# EasyEDA Pro project 外接板20250811.eprj

# Schematic Schematic1
Board Name: Board1; Create Date: 2025-08-11; Page Name: P1; Project Name: 外接板20250811; Schematic Name: Schematic1; Update Date: 2025-08-11; Company: 嘉立创EDA; Page Size: A4; Version: V1.0
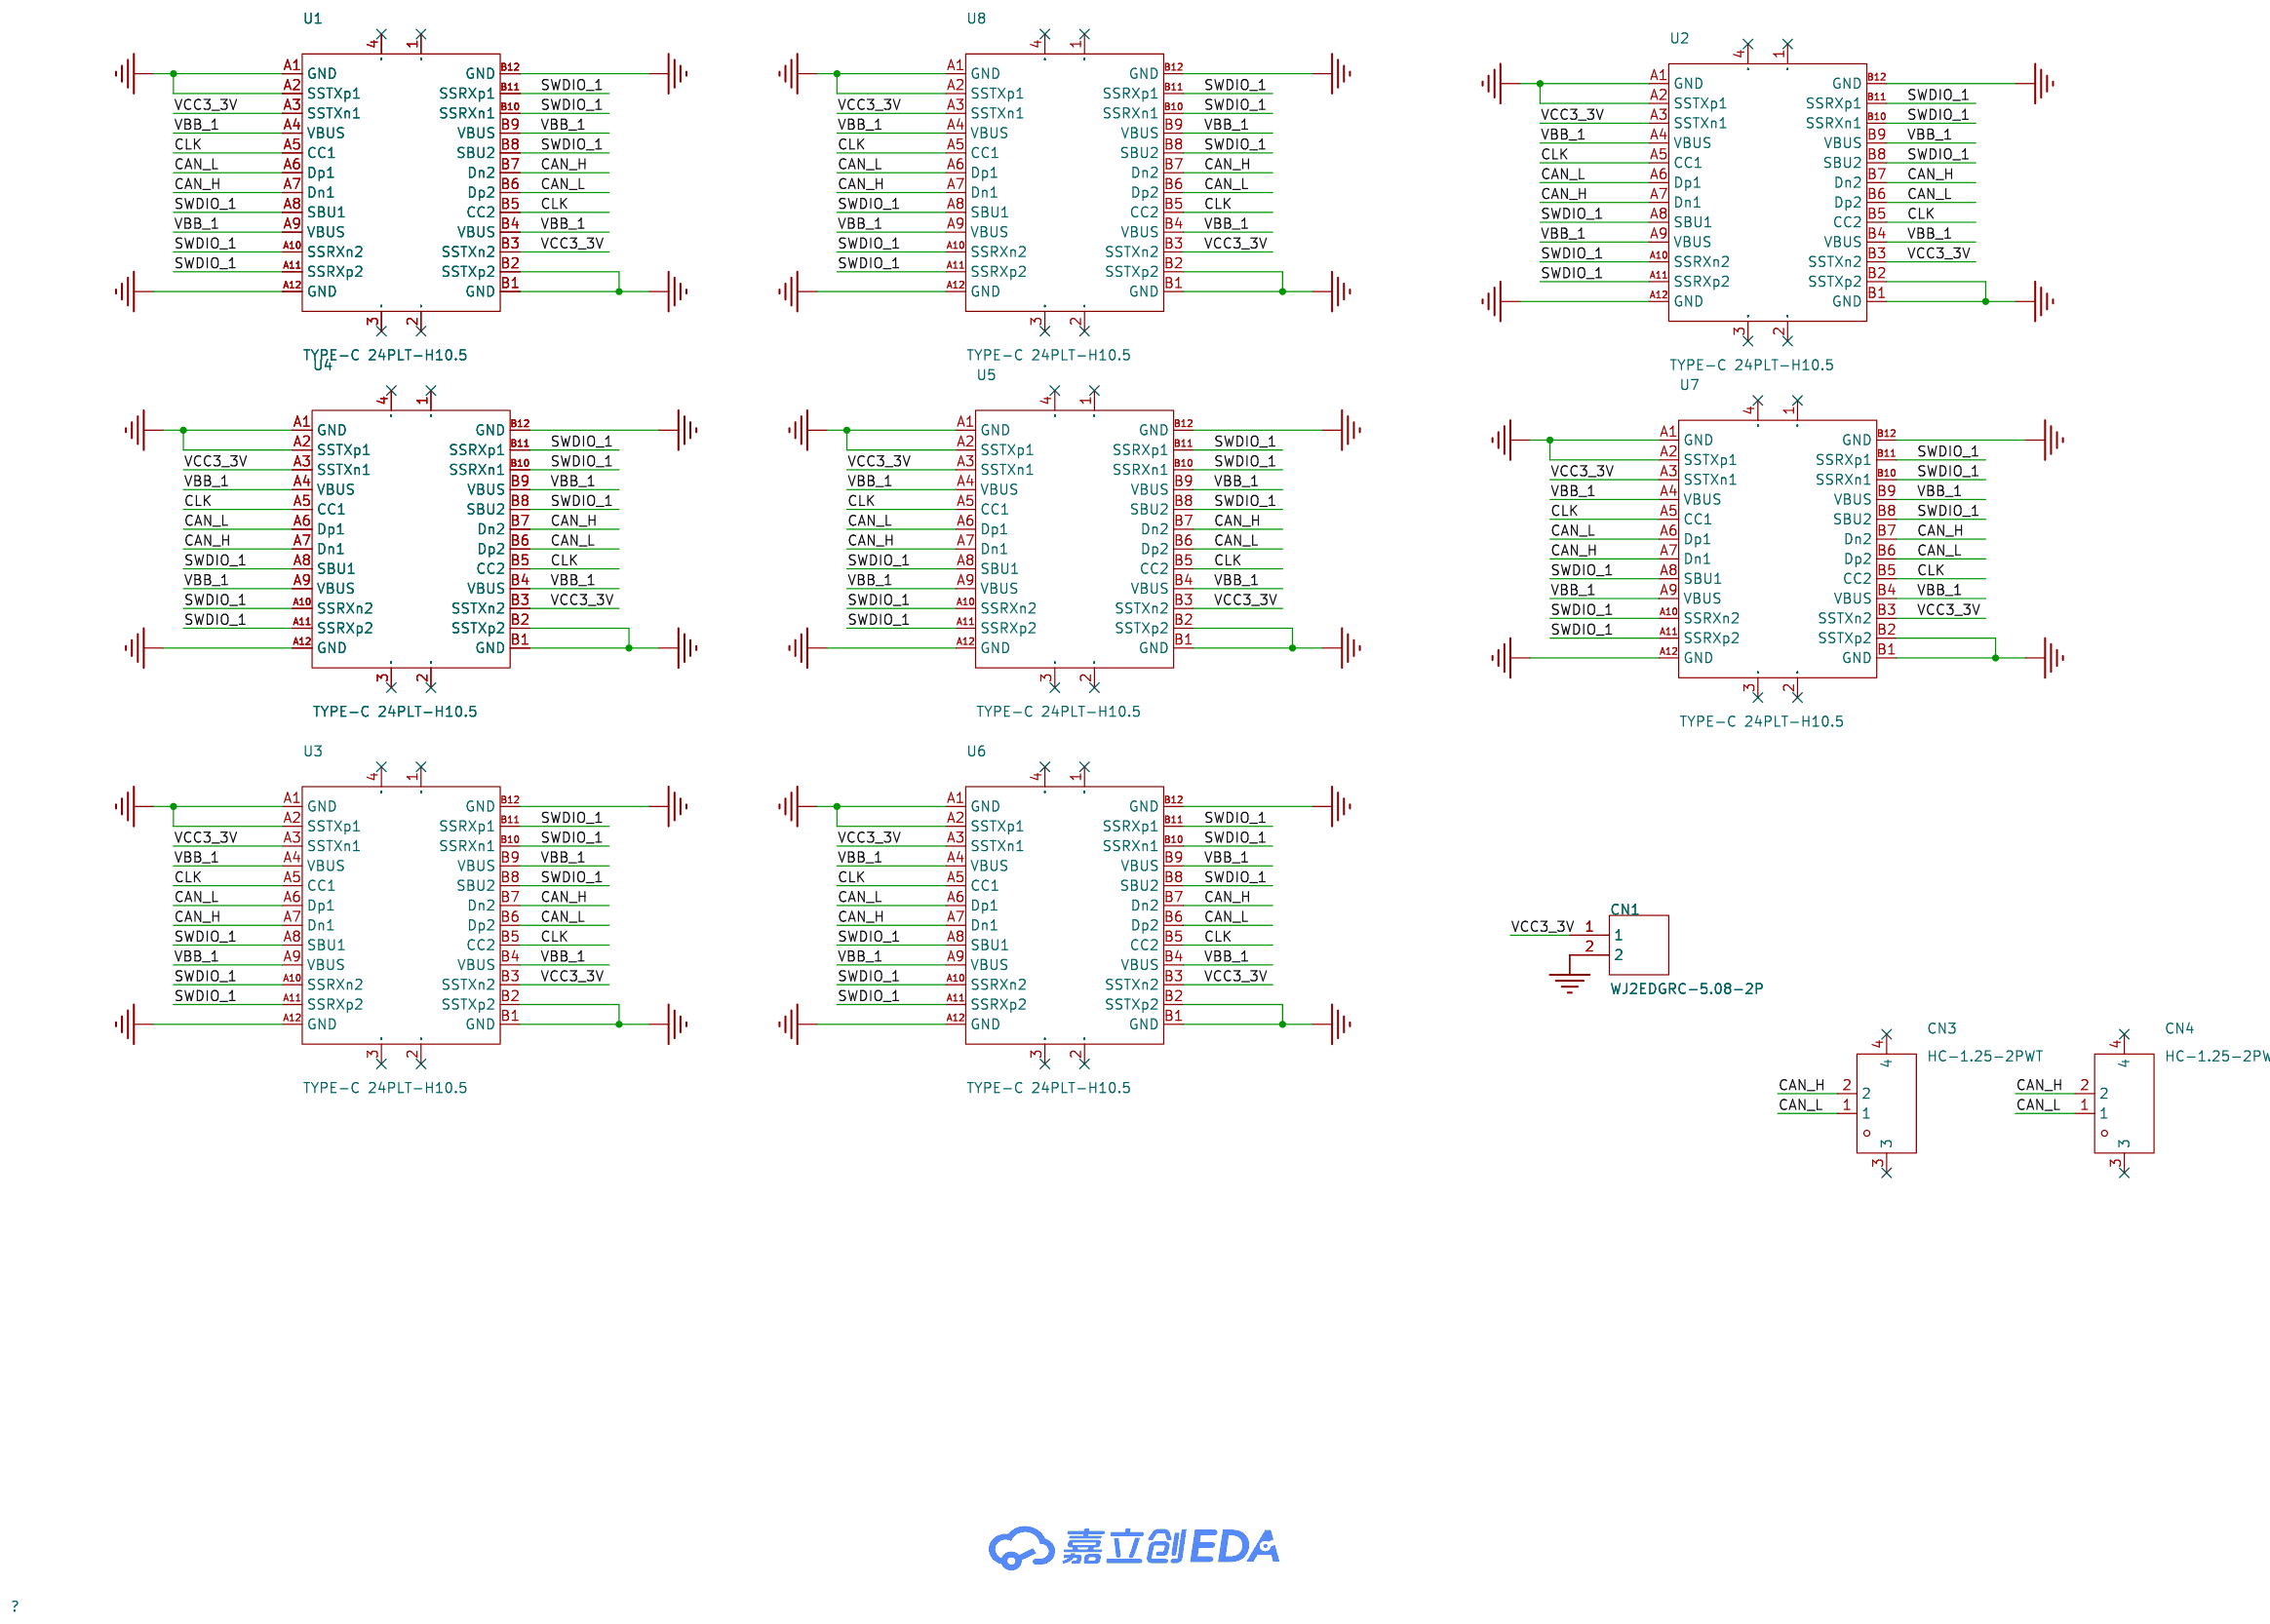
[diagram p0: schematic sheet]

## Parts
CN1  WJ2EDGRC-5.08-2P  [CONN-TH_2P-P5.08_WJ2EDGRC-5.08-2P]
CN3  HC-1.25-2PWT  [CONN-SMD_2P-P1.25-HC-1.25-2PWT]
CN4  HC-1.25-2PWT  [CONN-SMD_2P-P1.25-HC-1.25-2PWT]
U1  TYPE-C 24PLT-H10.5  [USB-C_TYPE-C-24PLT-H10.5-1]
U2  TYPE-C 24PLT-H10.5  [USB-C_TYPE-C-24PLT-H10.5-1]
U3  TYPE-C 24PLT-H10.5  [USB-C_TYPE-C-24PLT-H10.5-1]
U4  TYPE-C 24PLT-H10.5  [USB-C_TYPE-C-24PLT-H10.5-1]
U5  TYPE-C 24PLT-H10.5  [USB-C_TYPE-C-24PLT-H10.5-1]
U6  TYPE-C 24PLT-H10.5  [USB-C_TYPE-C-24PLT-H10.5-1]
U7  TYPE-C 24PLT-H10.5  [USB-C_TYPE-C-24PLT-H10.5-1]
U8  TYPE-C 24PLT-H10.5  [USB-C_TYPE-C-24PLT-H10.5-1]

## Library data of the parts
CN1 = WJ2EDGRC-5.08-2P: 连接器类型:板端/插座-闭口;固定方式:-;结构:1x2P;间距:5.08mm;颜色:绿色;安装方式:弯针;排数:1;每排PIN数:2;额定电流:20A;额定电压:450V;线规 - AWG:-;线规 - 平方毫米:-;触头材质:黄铜;触头镀层:锡;工作温度范围:-40℃~+105℃;焊接温度(最大值):-;; LCSC Part Name: 1x2P 5.08mm 排数:1 每排P数:2; Supplier Part: C3697; Manufacturer: KANGNEX(康奈克斯电气); Supplier Footprint: 弯插,P=5.08mm; JLCPCB Part Class: 扩展库; Datasheet: https://atta.szlcsc.com/upload/public/pdf/source/20240813/4D8AF133EBD88DD18E5AA0CE5EC77AA3.pdf; Supplier: LCSC; Connector Type: 板端/插座-闭口; Structure: 1x2P; Pitch: 5.08mm; Color: 绿色; Mounting Style: 弯针; Number of Pins: 2P; Number of Rows: 1; Number of PINs Per Row: 2; Current Rating (Max): 20A; Voltage Rating (Max): 450V; Contact Material: 黄铜; Contact Plating: 锡; Operating Temperature Range: -40℃~+105℃
CN3 CN4 = HC-1.25-2PWT: LCSC Part Name: 1x2P 间距:1.25mm 卧贴 系列:PicoBlade(MX 1.25); Supplier Part: C2845379; Manufacturer: HCTL(华灿天禄); Supplier Footprint: SMD,P=1.25mm,卧贴; JLCPCB Part Class: 扩展库; Datasheet: https://atta.szlcsc.com/upload/public/pdf/source/20240930/9508A8292CCC87B0C29E3A028D56E30A.pdf; Supplier: LCSC; Pins Structure: 1x2P; Pitch: 1.25mm; Mounting Style: 卧贴; Reference Series: PicoBlade(MX 1.25); Number of Pins: 2P; Number of Rows: 1; Number of PINs Per Row: 2; Current Rating (Max): 1A; Contact Material: 黄铜; Contact Plating: 锡; Operating Temperature Range: -40℃~+105℃; Rated Voltage (Max): 125V; Plastic Material: LCP; Flame Retardant Rating: UL94V-0; Supplementary Features: 辅助焊脚; Z-Height of the Board: 3.57mm; X-Length of Bottom Edge on Board (Spacing Line): 7.55mm; Y-Width of Bottom Edge on Board: 5.25mm
U1-U8 = TYPE-C 24PLT-H10.5: 连接器类型:Type-C;标准:USB 3.1;公母:母;安装方式:立贴;触点数量:24P;端口数量:1;额定电流 - 电源:5A;触头材质:-;触头镀层:-;工作温度范围:-40℃~+85℃;; LCSC Part Name: Type-C 母 立贴; Supplier Part: C3151750; Manufacturer: SHOU HAN(首韩); Supplier Footprint: SMD; JLCPCB Part Class: 扩展库; Datasheet: https://atta.szlcsc.com/upload/public/pdf/source/20220627/91FAFF0DC2678F248871B59BE141533F.pdf; Supplier: LCSC; Connector Type: Type-C; Standard: USB 3.1; Gender: 母; Mounting Style: 立贴; Number of Contacts: 24P; Number of Ports: 1; Current Rating - Power (Max): 5A; Operating Temperature Range: -40℃~+85℃; Rated Voltage (Max): 20V; Connect-Disconnect Life: 1万次; Core Colour: 黑色

## Nets
GND: CN1.2 U1.A1(GND) U1.A2(SSTXp1) U1.A12(GND) U1.B1(GND) U1.B2(SSTXp2) U1.B12(GND) U2.A1(GND) U2.A2(SSTXp1) U2.A12(GND) U2.B1(GND) U2.B2(SSTXp2) U2.B12(GND) U3.A1(GND) U3.A2(SSTXp1) U3.A12(GND) U3.B1(GND) U3.B2(SSTXp2) U3.B12(GND) U4.A1(GND) U4.A2(SSTXp1) U4.A12(GND) U4.B1(GND) U4.B2(SSTXp2) U4.B12(GND) U5.A1(GND) U5.A2(SSTXp1) U5.A12(GND) U5.B1(GND) U5.B2(SSTXp2) U5.B12(GND) U6.A1(GND) U6.A2(SSTXp1) U6.A12(GND) U6.B1(GND) U6.B2(SSTXp2) U6.B12(GND) U7.A1(GND) U7.A2(SSTXp1) U7.A12(GND) U7.B1(GND) U7.B2(SSTXp2) U7.B12(GND) U8.A1(GND) U8.A2(SSTXp1) U8.A12(GND) U8.B1(GND) U8.B2(SSTXp2) U8.B12(GND)
VCC3_3V: CN1.1 U1.A3(SSTXn1) U1.B3(SSTXn2) U2.A3(SSTXn1) U2.B3(SSTXn2) U3.A3(SSTXn1) U3.B3(SSTXn2) U4.A3(SSTXn1) U4.B3(SSTXn2) U5.A3(SSTXn1) U5.B3(SSTXn2) U6.A3(SSTXn1) U6.B3(SSTXn2) U7.A3(SSTXn1) U7.B3(SSTXn2) U8.A3(SSTXn1) U8.B3(SSTXn2)
CAN_H: CN3.2 CN4.2 U1.A7(Dn1) U1.B7(Dn2) U2.A7(Dn1) U2.B7(Dn2) U3.A7(Dn1) U3.B7(Dn2) U4.A7(Dn1) U4.B7(Dn2) U5.A7(Dn1) U5.B7(Dn2) U6.A7(Dn1) U6.B7(Dn2) U7.A7(Dn1) U7.B7(Dn2) U8.A7(Dn1) U8.B7(Dn2)
CAN_L: CN3.1 CN4.1 U1.A6(Dp1) U1.B6(Dp2) U2.A6(Dp1) U2.B6(Dp2) U3.A6(Dp1) U3.B6(Dp2) U4.A6(Dp1) U4.B6(Dp2) U5.A6(Dp1) U5.B6(Dp2) U6.A6(Dp1) U6.B6(Dp2) U7.A6(Dp1) U7.B6(Dp2) U8.A6(Dp1) U8.B6(Dp2)
CLK: U1.A5(CC1) U1.B5(CC2) U2.A5(CC1) U2.B5(CC2) U3.A5(CC1) U3.B5(CC2) U4.A5(CC1) U4.B5(CC2) U5.A5(CC1) U5.B5(CC2) U6.A5(CC1) U6.B5(CC2) U7.A5(CC1) U7.B5(CC2) U8.A5(CC1) U8.B5(CC2)
SWDIO_1: U1.A8(SBU1) U1.A10(SSRXn2) U1.A11(SSRXp2) U1.B8(SBU2) U1.B10(SSRXn1) U1.B11(SSRXp1) U2.A8(SBU1) U2.A10(SSRXn2) U2.A11(SSRXp2) U2.B8(SBU2) U2.B10(SSRXn1) U2.B11(SSRXp1) U3.A8(SBU1) U3.A10(SSRXn2) U3.A11(SSRXp2) U3.B8(SBU2) U3.B10(SSRXn1) U3.B11(SSRXp1) U4.A8(SBU1) U4.A10(SSRXn2) U4.A11(SSRXp2) U4.B8(SBU2) U4.B10(SSRXn1) U4.B11(SSRXp1) U5.A8(SBU1) U5.A10(SSRXn2) U5.A11(SSRXp2) U5.B8(SBU2) U5.B10(SSRXn1) U5.B11(SSRXp1) U6.A8(SBU1) U6.A10(SSRXn2) U6.A11(SSRXp2) U6.B8(SBU2) U6.B10(SSRXn1) U6.B11(SSRXp1) U7.A8(SBU1) U7.A10(SSRXn2) U7.A11(SSRXp2) U7.B8(SBU2) U7.B10(SSRXn1) U7.B11(SSRXp1) U8.A8(SBU1) U8.A10(SSRXn2) U8.A11(SSRXp2) U8.B8(SBU2) U8.B10(SSRXn1) U8.B11(SSRXp1)
VBB_1: U1.A4(VBUS) U1.A9(VBUS) U1.B4(VBUS) U1.B9(VBUS) U2.A4(VBUS) U2.A9(VBUS) U2.B4(VBUS) U2.B9(VBUS) U3.A4(VBUS) U3.A9(VBUS) U3.B4(VBUS) U3.B9(VBUS) U4.A4(VBUS) U4.A9(VBUS) U4.B4(VBUS) U4.B9(VBUS) U5.A4(VBUS) U5.A9(VBUS) U5.B4(VBUS) U5.B9(VBUS) U6.A4(VBUS) U6.A9(VBUS) U6.B4(VBUS) U6.B9(VBUS) U7.A4(VBUS) U7.A9(VBUS) U7.B4(VBUS) U7.B9(VBUS) U8.A4(VBUS) U8.A9(VBUS) U8.B4(VBUS) U8.B9(VBUS)

Not connected (* = marked no-connect by the designer): CN3 3* 4*; CN4 3* 4*; U1 1(SHEELD)* 2(SHEELD)* 3(SHEELD)* 4(SHEELD)*; U2 1(SHEELD)* 2(SHEELD)* 3(SHEELD)* 4(SHEELD)*; U3 1(SHEELD)* 2(SHEELD)* 3(SHEELD)* 4(SHEELD)*; U4 1(SHEELD)* 2(SHEELD)* 3(SHEELD)* 4(SHEELD)*; U5 1(SHEELD)* 2(SHEELD)* 3(SHEELD)* 4(SHEELD)*; U6 1(SHEELD)* 2(SHEELD)* 3(SHEELD)* 4(SHEELD)*; U7 1(SHEELD)* 2(SHEELD)* 3(SHEELD)* 4(SHEELD)*; U8 1(SHEELD)* 2(SHEELD)* 3(SHEELD)* 4(SHEELD)*

# Board PCB5
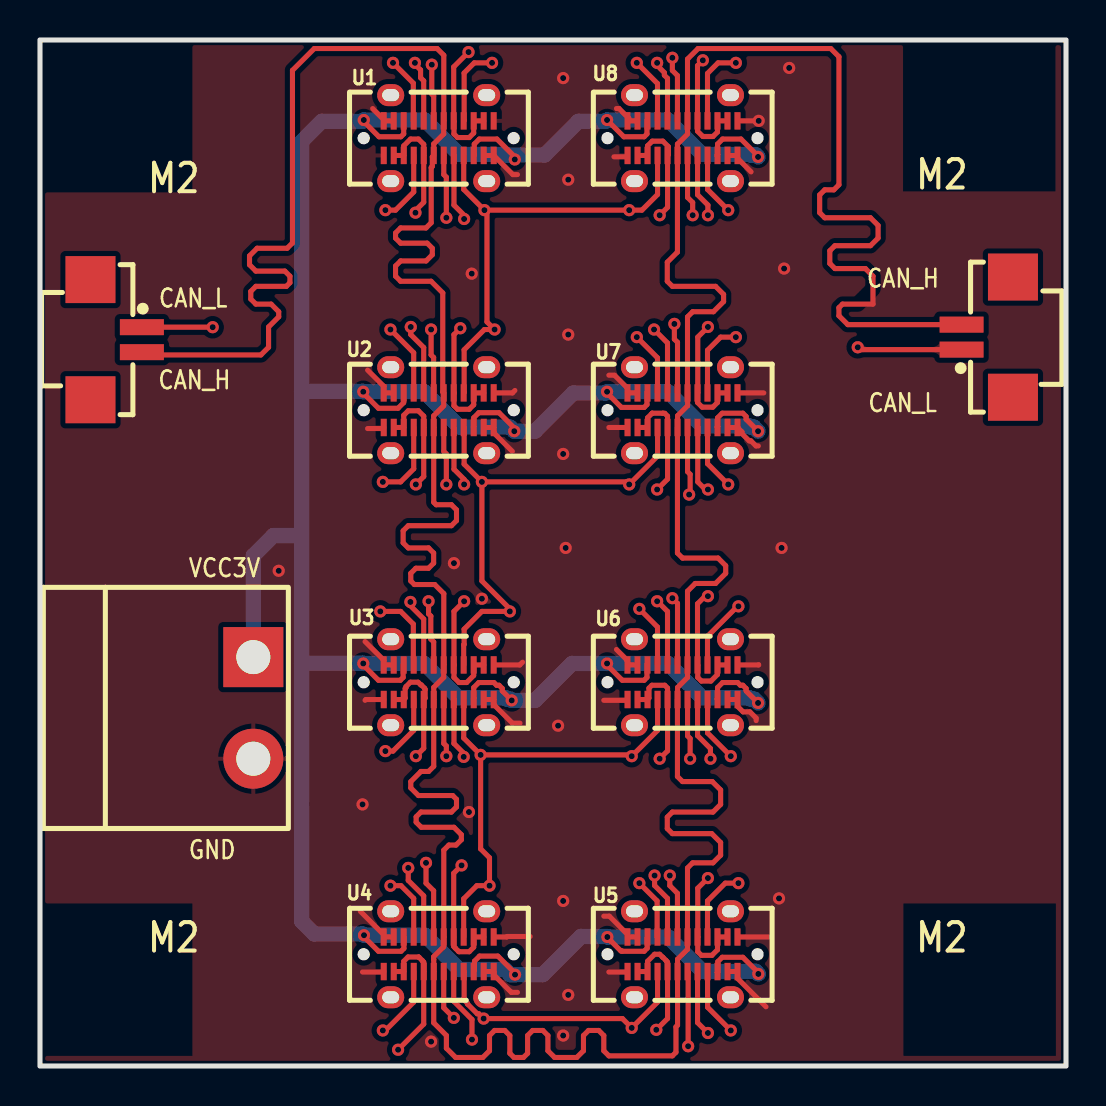
[diagram p1: board, top side]
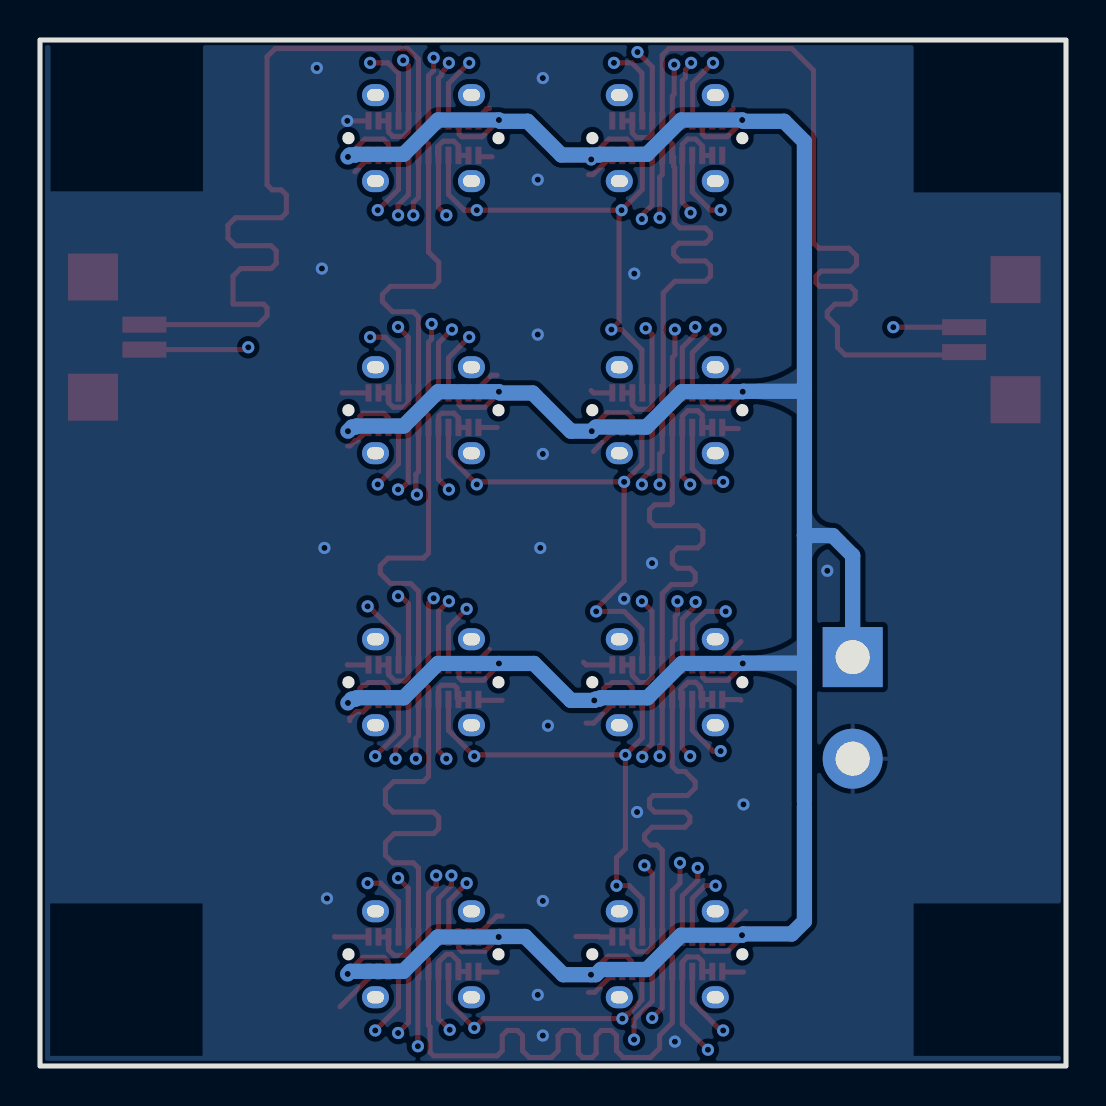
[diagram p2: board, bottom side, seen from below]

Outline 51.31 x 51.31 mm; copper layers: Top Layer, 内层1, 内层2, Inner3, Inner4, Bottom Layer. Coordinates in mm from the lower left corner of the outline.
Outline path: rectangle 0,51.31 51.31,0
Stack: Top Layer 0.035mm 外层铜厚1oz / Dielectric1 0.0994mm 3313 RC57% 4.2mil / 内层1 0.0152mm 内层铜厚 / Dielectric2 0.55mm 0.55mm H/H No copper / 内层2 0.0152mm 内层铜厚 / Dielectric3 0.1088mm 2116 RC54% 4.9mil / Inner3 0.0152mm 内层铜厚 / Dielectric4 0.55mm 0.55mm H/H No copper / Inner4 0.0152mm 内层铜厚 / Dielectric5 0.0994mm 3313 RC57% 4.2mil / Bottom Layer 0.035mm 外层铜厚1oz

## Design rules (mm)
net CAN_H: DP1
net CAN_L: DP1
template: JLCPCB Capability(Two Layers Board)
spacing copperThickness1oz (default): track to track 0.102, other pairs 0.152 to 0.3
spacing copperThickness2oz: track to track 0.203, other pairs 0.152 to 0.3
track width copperThickness1oz (default): min 0.127, default 0.254, max 2.54
track width copperThickness2oz: min 0.203, default 0.254, max 2.54
differential pair differentialPair (default): width min 0.127, default 0.254, max 2.54; gap min 0.152, default 0.152
via viaSize (default): diameter min 0.5, default 0.61, max 10; hole min 0.3, default 0.305, max 6.3

## Placement (name value [footprint] x y rotation side)
CN1  WJ2EDGRC-5.08-2P  [CONN-TH_2P-P5.08_WJ2EDGRC-5.08-2P]  10.67 17.91 270 top
CN3  HC-1.25-2PWT  [CONN-SMD_2P-P1.25-HC-1.25-2PWT]  47.37 36.45 90 top
CN4  HC-1.25-2PWT  [CONN-SMD_2P-P1.25-HC-1.25-2PWT]  3.81 36.32 270 top
U1  TYPE-C 24PLT-H10.5  [USB-C_TYPE-C-24PLT-H10.5-1]  19.94 46.4 0 top
U2  TYPE-C 24PLT-H10.5  [USB-C_TYPE-C-24PLT-H10.5-1]  19.94 32.8 0 top
U3  TYPE-C 24PLT-H10.5  [USB-C_TYPE-C-24PLT-H10.5-1]  19.94 19.19 0 top
U4  TYPE-C 24PLT-H10.5  [USB-C_TYPE-C-24PLT-H10.5-1]  19.94 5.59 0 top
U5  TYPE-C 24PLT-H10.5  [USB-C_TYPE-C-24PLT-H10.5-1]  32.13 5.59 0 top
U6  TYPE-C 24PLT-H10.5  [USB-C_TYPE-C-24PLT-H10.5-1]  32.13 19.19 0 top
U7  TYPE-C 24PLT-H10.5  [USB-C_TYPE-C-24PLT-H10.5-1]  32.13 32.8 0 top
U8  TYPE-C 24PLT-H10.5  [USB-C_TYPE-C-24PLT-H10.5-1]  32.13 46.4 0 top

## Footprints (pads in the part's own frame, mm; a bottom-side part is the same pattern mirrored in y, then rotated)
CONN-SMD_2P-P1.25-HC-1.25-2PWT
  rect 0.8x2.2 smd: 1(-0.625,1.285) 2(0.625,1.285)
  rect 2.35x2.5 smd: 3(-3.005,-1.285) 4(3.005,-1.285)
CONN-TH_2P-P5.08_WJ2EDGRC-5.08-2P
  rect 3x3 hole 1.7: 1(-2.54,0)
  round 3 hole 1.7: 2(2.54,0)
USB-C_TYPE-C-24PLT-H10.5-1
  oval 1.35x1.1 hole 0.85x0.6: 1(2.399,2.15) 2(-2.401,2.15) 3(-2.401,-2.15) 4(2.399,-2.15)
  rect 0.3x0.87 smd: A1(-2.751,0.865) A2(-2.251,0.865) A3(-1.751,0.865) A4(-1.251,0.865) A5(-0.751,0.865) A6(-0.251,0.865) A7(0.249,0.865) A8(0.749,0.865) A9(1.249,0.865) A10(1.749,0.865) A11(2.249,0.865) A12(2.749,0.865) B1(2.751,-0.865) B2(2.251,-0.865) B3(1.751,-0.865) B4(1.251,-0.865) B5(0.751,-0.865) B6(0.251,-0.865) B7(-0.249,-0.865) B8(-0.749,-0.865) B9(-1.249,-0.865) B10(-1.749,-0.865) B11(-2.249,-0.865) B12(-2.749,-0.865)

## Nets
As in the schematic.

Pads without a net: CN3 3 4; CN4 3 4; U1 1 2 3 4; U2 1 2 3 4; U3 1 2 3 4; U4 1 2 3 4; U5 1 2 3 4; U6 1 2 3 4; U7 1 2 3 4; U8 1 2 3 4

## Via types
v1: diameter 0.61, hole 0.305, Top Layer to Bottom Layer, 119 vias

## Routing (per net, layer and track width the routed paths; a pad name or vN(x,y) marks a point on that pad's centre or on a via; arc(x,y) is an arc through that point)
GND: length 48.4
  Top Layer w0.254: 28.7,45.47 29.31,45.47 U8.B12 ; U5.B2 U5.B1 34.88,4.38 36.3,2.96 ; U8.A12 v1(35.94,47.26) ; U7.A12 36.2,33.66 ; 35.92,31.01 35.81,31.01 35.55,31.26 35.46,31.26 35.1,31.63 35.1,31.71 U7.B1 U7.B2 ; U4.A12 23.34,6.45 23.37,6.48 24.51,6.48 ; U5.A12 36.55,6.45 36.58,6.48 ; 16.64,47.88 17.19,47.33 U1.A1 U1.A2 ; 23.88,3.68 23.57,3.68 22.69,4.56 U4.B1 U4.B2 ; 16.26,18.29 16.3,18.33 U3.B12 ; U4.B12 17.17,4.7 16.13,4.7 ; 16.38,34.8 17.19,33.99 U2.A1 U2.A2 ; U3.A12 23.99,20.06 24.13,20.19 ; U3.A2 U3.A1 17.19,20.29 16.26,21.23 ; U6.A2 U6.A1 29.38,20.28 28.83,20.83 ; 23.62,30.73 22.69,31.67 U2.B1 U2.B2 ; U8.A2 U8.A1 29.44,47.33 29.44,47.39 28.96,47.88 28.83,47.88 ; 24,17.14 23.62,17.14 22.69,18.08 U3.B1 U3.B2 ; 28.19,18.29 29.34,18.29 U6.B12 ; U2.A12 23.63,33.66 23.75,33.78 ; U6.B2 U6.B1 34.88,17.99 35.16,17.71 35.5,17.71 35.81,17.39 35.81,17.27 ; 35.94,20.07 35.93,20.06 U6.A12 ; U2.B12 17.14,31.88 16.38,31.88 ; U7.B12 28.45,31.93 ; 35.56,44.71 34.88,45.39 U8.B1 U8.B2 ; U5.A2 U5.A1 29.38,6.58 28.47,7.49 28.19,7.49 ; 28.45,34.54 28.73,34.54 29.38,33.89 U7.A1 U7.A2 ; 16.02,7.74 17.19,6.57 U4.A1 U4.A2 ; 23.88,44.58 23.65,44.58 U1.B1 U1.B2 ; U5.B12 29.36,4.7 28.45,4.7
  vias: v1(11.94,24.77) v1(16.13,13.08) v1(19.56,1.22) v1(20.7,25.15) v1(21.45,12.7) v1(21.59,39.62) v1(22.1,23.37) v1(25.91,17.02) v1(26.16,49.4) v1(26.16,30.61) v1(26.16,8.25) v1(26.16,1.52) v1(26.29,25.91) v1(26.42,44.32) v1(26.42,36.58) v1(26.42,3.56) v1(36.96,8.38) v1(37.08,25.91) v1(37.21,39.88) v1(37.46,49.91)
VCC3_3V: length 197.1
  Top Layer w0.254: U1.A3 18.19,46.61 18.05,46.47 16.95,46.47 16.19,47.23 v1(16.19,47.31) ; v1(35.91,31.74) 35.31,32.34 35.31,32.48 35.15,32.64 34.12,32.64 33.88,32.41 33.88,31.97 33.86,31.95 ; v1(16.17,20.13) 16.17,20.05 16.92,19.29 18.02,19.29 18.16,19.43 18.16,20.09 ; 30.35,33.68 30.35,33.08 30.21,32.94 29.07,32.94 28.36,33.65 v1(28.36,33.72) ; v1(35.92,4.6) 35.92,4.66 35.15,5.44 34.12,5.44 33.89,5.22 33.89,4.7 33.87,4.68 ; v1(35.91,18.16) 35.31,18.75 35.31,18.88 35.15,19.04 35.02,19.04 34.89,19.18 34.14,19.18 33.88,18.92 33.88,18.38 33.86,18.36 ; v1(35.91,45.46) 35.91,45.5 35.05,46.36 34.14,46.36 33.88,46.1 33.88,45.56 33.86,45.53 ; U2.A3 18.19,33.17 17.91,32.89 16.92,32.89 16.17,33.65 v1(16.17,33.72) ; v1(23.74,45.33) 23.74,45.46 22.85,46.36 21.97,46.36 21.72,46.1 21.72,45.56 U1.B3 ; v1(16.2,6.54) 16.2,6.46 16.92,5.74 18.06,5.74 18.2,5.88 18.2,6.5 ; v1(28.36,20.13) 28.36,20.05 29.12,19.29 30.21,19.29 30.35,19.43 30.35,20.09 ; v1(28.37,6.45) 28.37,6.42 28.56,6.22 28.58,6.22 29.05,5.75 29.1,5.75 29.11,5.74 30.21,5.74 30.37,5.89 30.37,6.41 ; 21.7,4.77 21.73,4.79 21.73,5.24 21.98,5.5 22.9,5.5 23.75,4.64 v1(23.75,4.57) ; v1(23.72,31.74) 23.72,31.91 22.96,32.67 21.94,32.67 21.69,32.42 21.69,31.97 21.66,31.95 ; 30.35,47.26 30.35,46.61 30.21,46.47 29.2,46.47 v1(28.36,47.31) ; v1(23.59,18.28) 23.12,18.75 23.12,18.88 22.96,19.04 22.83,19.04 22.7,19.18 21.94,19.18 21.69,18.92 21.69,18.38 21.66,18.36
  Bottom Layer w0.762: 13.08,26.53 13.08,33.74 ; 13.08,26.53 13.08,20.14 ; 13.08,26.53 11.67,26.53 10.67,25.53 CN1.1 ; 13.08,33.74 13.08,46.23 14.1,47.24 16.13,47.24 v1(16.19,47.31) 19.24,47.31 20.95,45.59 23.3,45.59 23.34,45.56 23.74,45.56 ; 13.08,33.74 16.14,33.74 v1(16.17,33.72) 19.21,33.72 20.98,31.95 23.51,31.95 v1(23.72,31.74) 24.76,31.74 26.67,33.66 28.29,33.66 v1(28.36,33.72) 31.41,33.72 33.12,32 35.48,32 35.53,31.95 35.7,31.95 v1(35.91,31.74) ; v1(35.91,18.16) 35.72,18.35 35.53,18.35 35.47,18.42 33.12,18.42 31.41,20.13 v1(28.36,20.13) 26.61,20.13 24.76,18.28 v1(23.59,18.28) 23.52,18.35 23.34,18.35 23.27,18.42 20.93,18.42 19.21,20.13 v1(16.17,20.13) 16.15,20.14 13.08,20.14 ; 13.08,13.21 13.08,20.14 ; 23.97,45.56 25.24,45.56 26.92,47.24 28.29,47.24 v1(28.36,47.31) 31.41,47.31 33.12,45.59 35.5,45.59 35.53,45.56 35.81,45.56 v1(35.91,45.46) ; 13.08,13.02 13.08,7.24 13.72,6.6 16.14,6.6 v1(16.2,6.54) 19.25,6.54 20.97,4.83 23.26,4.83 23.52,4.57 v1(23.75,4.57) 25.14,4.57 27.05,6.48 28.34,6.48 v1(28.37,6.45) 31.42,6.45 33.13,4.74 35.79,4.74 v1(35.92,4.6)
CAN_H: length 225
  Top Layer w0.254: CN3.2 40.4,37.07 39.95,37.52 39.95,37.92 40.13,38.1 41.66,38.1 41.66,39.5 41.27,39.88 39.75,39.88 39.5,40.13 39.5,40.77 39.75,41.02 41.53,41.02 41.91,41.4 41.91,42.04 41.53,42.42 39.24,42.42 38.99,42.67 38.99,43.56 39.24,43.81 39.7,43.81 39.95,44.07 39.95,50.47 39.54,50.88 32.91,50.88 32.38,50.35 U8.A7 32.38,46.6 31.88,46.1 31.88,45.54 U8.B7 31.88,45.53 31.88,40.7 31.37,40.2 31.37,39.24 31.62,38.99 33.78,38.99 34.18,38.59 34.18,38.23 33.68,37.72 32.64,37.72 32.38,37.46 U7.A7 32.39,33.66 32.39,33.02 31.88,32.52 U7.B7 31.88,31.93 31.88,25.65 32.13,25.4 33.91,25.4 34.29,25.02 34.29,24.64 33.78,24.13 32.77,24.13 32.38,23.74 U6.A7 32.38,19.43 31.88,18.93 U6.B7 31.88,18.32 31.88,14.48 32.13,14.22 33.62,14.22 34.04,13.81 34.04,13.08 33.65,12.7 31.62,12.7 31.37,12.45 31.37,11.87 31.62,11.62 33.59,11.62 34.04,11.18 34.04,10.54 33.65,10.16 32.64,10.16 32.38,9.9 U5.A7 32.38,5.84 31.88,5.34 U5.B7 31.88,2.04 31.8,1.96 31.8,0.69 31.62,0.51 28.45,0.51 28.19,0.76 28.19,1.52 27.94,1.78 27.43,1.78 27.18,1.52 27.18,0.76 26.84,0.43 25.73,0.43 25.4,0.76 25.4,1.52 25.15,1.78 24.64,1.78 24.38,1.52 24.38,0.63 24.18,0.43 23.7,0.43 23.49,0.63 23.49,1.52 23.24,1.78 22.73,1.78 22.48,1.52 22.48,0.76 22.14,0.43 20.78,0.43 20.32,0.89 20.32,1.53 19.69,2.16 U4.B7 19.69,5.33 19.68,5.33 19.68,5.46 20.19,5.96 U4.A7 20.19,6.46 20.19,10.8 20.45,11.05 20.81,11.05 21.07,11.31 21.07,11.57 20.7,11.94 19.06,11.94 18.81,12.19 18.81,12.46 19.05,12.7 20.57,12.7 20.83,12.95 20.83,13.34 20.64,13.53 18.92,13.53 18.54,13.91 18.54,14.22 19.05,14.73 19.43,14.73 19.69,14.99 U3.B7 19.69,18.93 20.19,19.43 U3.A7 20.19,20.06 20.19,23.62 19.74,24.08 18.72,24.08 18.54,24.26 18.54,24.64 18.8,24.89 19.43,24.89 19.68,25.15 19.68,25.65 19.43,25.91 18.42,25.91 18.16,26.16 18.16,26.77 18.42,27.02 20.57,27.02 20.83,27.27 20.83,27.81 20.57,28.07 19.81,28.07 19.69,28.19 U2.B7 19.68,31.94 19.68,32.51 20.19,33.02 U2.A7 20.14,33.71 20.14,38.66 19.56,39.24 18.03,39.24 17.78,39.5 17.78,40 18.03,40.26 19.31,40.26 19.62,40.57 19.62,40.89 19.36,41.15 18.03,41.15 17.78,41.4 17.78,41.66 18.03,41.91 19.3,41.91 19.56,42.17 19.56,44.93 19.62,44.98 19.62,45.46 U1.B7 19.69,46.11 20.19,46.61 U1.A7 20.19,47.27 20.19,50.55 19.86,50.88 13.72,50.88 12.63,49.79 12.63,41.16 12.36,40.89 10.86,40.89 10.48,40.51 10.48,40.07 10.8,39.75 12.24,39.75 12.5,39.5 12.5,39.17 12.32,38.99 10.8,38.99 10.54,38.73 10.54,38.35 10.8,38.1 11.56,38.1 11.94,37.72 11.94,37.47 11.43,36.96 11.43,35.94 11.05,35.56 5.23,35.56 CN4.2
CAN_L: length 224.6
  Top Layer w0.254: U5.B6 32.41,4.69 v1(32.41,0.99) ; 32.51,16.38 32.38,16.51 U6.B6 ; U1.A6 19.69,48.51 19.59,48.61 v1(19.59,50.07) ; v1(40.89,35.94) 41.01,35.82 CN3.1 ; v1(31.5,9.53) 31.5,9.02 31.88,8.64 31.88,6.46 U5.A6 ; 32.51,16.38 v1(32.51,15.37) ; U4.A6 19.68,6.46 19.68,8.76 19.3,9.14 v1(19.3,10.16) ; U8.A6 31.88,47.27 31.88,49.53 31.62,49.78 v1(31.62,50.42) ; v1(32.46,28.58) 32.51,28.63 32.51,29.59 32.38,29.72 U7.B6 ; v1(20.7,2.41) 20.19,2.91 U4.B6 ; U2.A6 19.68,33.66 19.68,35.43 19.56,35.56 v1(19.56,36.83) ; v1(20.32,15.49) 20.32,16 20.19,16.13 20.19,18.32 U3.B6 ; U1.B6 20.19,45.53 20.19,44.58 20.32,44.45 v1(20.32,42.42) ; v1(31.72,37.11) 31.72,36.35 31.88,36.19 U7.A6 ; U8.B6 32.38,43.44 32.64,43.18 v1(32.64,42.55) ; U6.A6 31.88,23.14 v1(31.62,23.39) ; U2.B6 20.19,31.93 20.19,30.73 20.32,30.61 v1(20.32,29.08) ; CN4.1 v1(8.64,36.95) ; U3.A6 19.69,21.21 19.54,21.35 19.54,22.5 19.43,22.61 v1(19.43,23.24)
  内层2 w0.254: v1(40.89,35.94) 40.13,36.7 40.13,50.42 39.67,50.88 32.08,50.88 v1(31.62,50.42) 31.62,46.23 32.64,45.21 v1(32.64,42.55) 32.64,39.62 31.72,38.71 v1(31.72,37.11) 31.75,37.08 31.75,33.02 32.46,32.31 v1(32.46,28.58) 32.51,28.52 32.51,25.91 31.62,25.02 v1(31.62,23.39) 31.62,19.56 32.51,18.67 v1(32.51,15.37) 32.51,13.72 31.5,12.7 v1(31.5,9.53) 31.5,5.84 32.41,4.93 v1(32.41,0.99) 32.06,0.63 21.08,0.63 20.7,1.02 v1(20.7,2.41) 20.7,2.41 20.7,5.08 19.3,6.48 v1(19.3,10.16) 19.3,12.7 20.32,13.72 v1(20.32,15.49) 20.32,18.8 19.43,19.69 v1(19.43,23.24) 19.43,26.67 20.32,27.56 v1(20.32,29.08) 20.32,33.15 19.56,33.91 v1(19.56,36.83) 19.56,39.62 20.32,40.39 v1(20.32,42.42) 20.32,45.97 19.56,46.74 19.56,50.04 v1(19.59,50.07) 19.59,50.46 19.18,50.88 10.95,50.88 9.96,49.89 9.96,37.13 9.78,36.95 v1(8.64,36.95)
CLK: length 186.5
  Top Layer w0.254: U7.A5 31.38,36.16 v1(30.71,36.83) ; U8.B5 32.88,43.57 33.4,43.05 v1(33.4,42.55) ; v1(30.86,23.24) 30.87,23.24 31.38,22.73 U6.A5 ; U6.B5 32.88,16.52 33.53,15.88 v1(33.53,15.37) ; v1(30.73,9.53) 30.73,9.03 31.38,8.38 U5.A5 ; v1(18.52,23.21) 18.52,23.02 19.19,22.35 U3.A5 ; U2.B5 20.7,31.92 20.7,29.84 21.21,29.34 v1(21.21,29.08) ; U7.B5 32.89,31.92 32.89,29.21 33.27,28.83 v1(33.4,28.83) ; v1(18.42,9.91) 18.42,9.28 19.19,8.51 U4.A5 ; 18.75,50.09 19.03,49.81 19.03,49.42 19.19,49.27 U1.A5 ; U1.B5 20.7,45.52 20.7,43.05 21.21,42.55 v1(21.21,42.36) ; v1(18.54,36.96) 18.54,36.58 19.19,35.93 U2.A5 ; v1(30.86,50.17) 30.86,50.04 31.22,49.68 31.22,49.55 31.38,49.39 U8.A5 ; v1(33.4,1.65) 32.88,2.17 U5.B5 ; v1(21.6,1.32) 21.6,2.33 20.69,3.24 U4.B5 ; U3.B5 20.7,18.32 20.7,16.13 21.19,15.64 v1(21.19,15.46)
  内层1 w0.254: v1(30.86,50.17) 30.86,47.5 33.4,44.96 v1(33.4,42.55) 33.4,40 32.89,39.5 31.5,39.5 30.86,38.86 30.86,36.98 v1(30.71,36.83) 30.71,33.94 33.4,31.24 v1(33.4,28.83) 33.4,26.29 33.02,25.91 31.11,25.91 30.86,25.65 v1(30.86,23.24) 30.86,20.45 33.53,17.78 v1(33.53,15.37) 33.59,15.3 33.59,12.89 33.15,12.45 31.24,12.45 30.73,11.94 v1(30.73,9.53) 30.73,6.73 33.4,4.06 v1(33.4,1.65) 33.35,1.6 31.98,1.6 31.8,1.78 31.8,2.36 31.62,2.54 23.49,2.54 22.28,1.32 v1(21.6,1.32) 20.9,1.32 19.94,2.29 19.94,8.38 v1(18.42,9.91) 18.42,12.57 18.92,13.08 20.83,13.08 21.19,13.44 v1(21.19,15.46) 21.19,17.87 18.52,20.54 v1(18.52,23.21) 18.54,23.23 18.54,26.29 19.05,26.8 20.83,26.8 21.21,27.18 v1(21.21,29.08) 21.21,31.5 18.54,34.16 v1(18.54,36.96) 18.54,39.12 19.18,39.75 20.7,39.75 21.21,40.26 v1(21.21,42.36) 21.21,42.55 20.7,43.05 20.7,46.1 20.32,46.48 19.56,46.48 19.18,46.86 19.18,48.64 18.75,49.07 18.75,50.09
  vias: v1(18.75,50.17)
SWDIO_1: length 238.5
  Top Layer w0.254: v1(30.99,42.55) 31.38,42.94 U8.B8 31.42,45.57 31.42,45.98 31.15,46.25 30.62,46.25 30.38,46.01 U8.B10 U8.B11 ; v1(33.4,9.4) 32.89,8.89 32.89,6.47 U5.A8 32.89,6.44 32.89,5.72 33.07,5.54 33.6,5.54 33.88,5.81 U5.A10 U5.A11 ; U2.B11 U2.B10 18.19,32.54 18.42,32.77 18.92,32.77 19.19,32.5 U2.B8 19.19,29.48 v1(18.8,29.08) ; v1(18.8,15.49) 19.19,15.89 U3.B8 19.26,18.4 19.26,18.84 19.23,18.87 19.23,18.89 19.07,19.06 19.04,19.06 18.91,19.19 18.52,19.19 18.3,18.97 18.3,18.92 18.26,18.88 18.26,18.4 U3.B10 U3.B11 ; v1(21.02,36.89) 20.7,36.58 20.7,33.67 U2.A8 20.7,33.65 20.7,33.02 20.88,32.84 21.46,32.84 21.69,33.07 U2.A10 U2.A11 ; v1(33.4,36.96) 32.89,36.45 32.89,33.67 U7.A8 32.88,33.18 33.11,32.95 33.65,32.95 33.88,33.18 U7.A10 U7.A11 ; U4.A11 U4.A10 21.69,5.94 21.46,5.72 20.95,5.72 20.93,5.74 20.92,5.74 20.76,5.9 20.76,5.91 20.69,5.98 U4.A8 20.69,9.64 v1(21.08,10.03) ; U4.B11 U4.B10 18.19,5.24 18.41,5.45 18.93,5.45 18.95,5.44 18.96,5.44 19.12,5.27 19.12,5.27 19.19,5.19 U4.B8 19.19,2.1 v1(17.91,0.81) ; v1(30.99,15.37) 31.38,15.76 U6.B8 31.38,18.9 31.24,19.04 30.6,19.04 30.45,18.9 30.45,18.4 U6.B10 U6.B11 ; v1(33.4,23.5) 33.26,23.5 32.88,23.11 U6.A8 32.89,20.04 32.89,19.43 33.07,19.25 33.55,19.25 33.88,19.58 U6.A10 U6.A11 ; v1(21.21,23.24) 20.7,22.73 20.7,20.07 U3.A8 20.7,20.04 20.7,19.43 20.95,19.18 21.34,19.18 21.69,19.53 U3.A10 U3.A11 ; U7.B11 U7.B10 30.38,32.41 30.61,32.64 30.61,32.64 30.62,32.64 31.15,32.64 31.15,32.64 31.24,32.64 31.38,32.5 U7.B8 31.38,29.35 v1(30.86,28.83) ; v1(21.43,50.7) 20.69,49.96 U1.A8 20.7,47.25 20.7,46.61 20.88,46.43 21.46,46.43 21.69,46.65 U1.A10 U1.A11 ; v1(30.82,1.81) 31.38,2.37 U5.B8 31.38,5.19 31.31,5.27 31.31,5.27 31.15,5.44 31.14,5.44 30.99,5.59 30.73,5.59 30.38,5.24 U5.B10 U5.B11 ; v1(33.15,50.29) 32.88,50.03 U8.A8 32.88,46.75 33.15,46.48 33.65,46.48 33.88,46.71 U8.A10 U8.A11 ; U1.B11 U1.B10 18.19,46.01 18.53,46.36 18.92,46.36 19.19,46.09 U1.B8 19.19,43.19 18.78,42.78 v1(18.78,42.67)
  Inner3 w0.254: v1(33.15,50.29) 33.15,46.99 32.51,46.36 31.5,46.36 31.05,45.91 31.05,42.61 v1(30.99,42.55) 30.99,40 31.37,39.62 33.02,39.62 33.4,39.24 v1(33.4,36.96) 33.4,33.4 33.15,33.15 31.5,33.15 30.86,32.51 v1(30.86,28.83) 30.94,28.75 30.94,26.34 31.11,26.16 32.64,26.16 33.4,25.4 v1(33.4,23.5) 33.33,23.42 33.33,19.48 33.15,19.3 31.24,19.3 30.99,19.05 v1(30.99,15.37) 31.06,15.29 31.06,12.63 31.24,12.45 32.77,12.45 33.4,11.81 v1(33.4,9.4) 33.45,9.35 33.45,5.64 33.27,5.46 31.24,5.46 30.86,5.08 30.86,1.85 v1(30.82,1.81) 30.82,1.23 30.23,0.63 18.08,0.63 v1(17.91,0.81) 18.86,1.77 18.86,5.02 19.3,5.46 20.57,5.46 21.08,5.97 v1(21.08,10.03) 21.08,12.06 20.57,12.57 19.3,12.57 18.8,13.08 v1(18.8,15.49) 18.87,15.57 18.87,19 19.05,19.18 20.83,19.18 21.21,19.56 v1(21.21,23.24) 21.34,23.37 21.34,26.42 21.13,26.62 18.98,26.62 18.8,26.8 v1(18.8,29.08) 18.8,32.64 18.98,32.82 20.75,32.82 21.02,33.08 v1(21.02,36.89) 21.02,39.18 20.57,39.62 19.18,39.62 18.8,40 18.8,42.65 v1(18.78,42.67) 19.18,43.07 19.18,46.18 19.43,46.43 20.52,46.43 21.38,47.29 21.38,50.66 v1(21.43,50.7)
VBB_1: length 299.7
  Top Layer w0.254: U4.A9 21.19,8.36 21.84,9.02 v1(22.48,9.02) 22.48,10.41 22.03,10.86 v1(22.03,15.56) ; U4.B9 18.69,3.2 17.27,1.78 v1(17.14,1.78) ; v1(17.27,15.75) 17.65,15.75 18.69,16.78 U3.B9 ; U2.A4 18.69,35.67 v1(17.53,36.83) ; v1(22.1,29.21) 22.1,24.26 23.49,22.86 v1(23.49,22.73) 22.1,22.73 21.21,21.84 21.21,21.08 21.19,21.06 U3.A9 ; v1(22.1,29.21) 29.34,29.21 v1(29.46,29.08) 30.88,30.5 U7.B9 ; v1(22.1,29.21) 21.21,30.1 21.21,31.91 U2.B4 ; U4.A4 18.69,8.38 18.05,9.02 v1(17.53,9.02) ; v1(34.54,15.49) 33.38,16.66 U6.B4 ; U1.B9 18.69,43.71 17.78,42.8 v1(17.27,42.8) ; v1(17.65,50.17) 18.67,49.15 18.67,47.28 U1.A4 ; U8.B4 33.38,43.83 v1(34.42,42.8) ; U1.B4 21.19,43.83 v1(22.23,42.8) ; U5.A4 30.86,6.47 30.86,8.25 v1(29.97,9.14) ; U4.B4 21.21,4.7 21.21,3.3 21.38,3.13 21.38,3.09 21.87,2.61 21.95,2.61 v1(22.19,2.37) 29.12,2.37 v1(29.59,1.91) 30.88,3.2 U5.B9 ; U6.A9 33.38,21.49 34.88,22.99 v1(34.92,22.99) ; U7.B4 33.38,30.12 v1(34.42,29.08) ; U2.A9 21.21,33.68 21.21,35.81 22.23,36.83 v1(22.73,36.83) 22.35,37.21 22.35,42.67 v1(22.23,42.8) ; v1(22.23,42.8) v1(29.46,42.8) 30.1,42.8 30.88,43.58 U8.B9 ; U8.A4 30.88,49.13 v1(29.84,50.17) ; v1(29.84,36.45) 30.88,35.41 U7.A4 ; v1(29.97,22.86) 30.88,21.95 U6.A4 ; 18.67,20.45 18.67,22.1 18.03,22.73 v1(17.02,22.73) ; v1(22.03,15.56) 29.53,15.56 v1(29.59,15.49) 30.88,16.78 U6.B9 ; v1(22.03,15.56) 21.19,16.4 U3.B4 ; v1(17.14,29.21) 18.03,29.21 18.69,29.87 U2.B9 ; U8.A9 33.38,49.64 33.91,50.17 v1(34.8,50.17) ; v1(22.61,50.17) 21.72,50.17 21.21,49.66 21.21,47.29 U1.A9 ; U5.B4 33.38,2.94 v1(34.54,1.78) ; v1(34.92,9.14) 34.27,9.14 33.38,8.25 U5.A9 ; U7.A9 33.38,35.79 34.04,36.45 v1(34.8,36.45)
  Inner4 w0.254: v1(17.14,1.78) 17.16,1.79 18.96,1.79 18.98,1.78 ; 19.75,29.97 18.67,29.97 17.91,29.21 v1(17.14,29.21) ; 19.75,29.97 21.34,29.97 v1(22.1,29.21) ; 19.75,29.97 19.75,35.79 19.72,35.81 ; 20.03,16.38 20,16.41 20,21.84 ; 20.03,16.38 18.29,16.38 17.65,15.75 v1(17.27,15.75) ; 20.03,16.38 21.21,16.38 v1(22.03,15.56) ; 32.4,35.81 30.48,35.81 v1(29.84,36.45) ; 32.4,35.81 34.16,35.81 v1(34.8,36.45) ; 32.4,35.81 32.4,35.05 32.26,34.91 32.26,29.59 ; 32.53,22.1 32.53,16.51 ; 32.53,22.1 33.99,22.1 34.88,22.99 v1(34.92,22.99) ; 32.53,22.1 30.73,22.1 v1(29.97,22.86) ; 32.53,16.51 30.86,16.51 29.84,15.49 v1(29.59,15.49) ; 32.53,16.51 33.53,16.51 v1(34.54,15.49) ; v1(22.23,42.8) 21.59,43.43 19.97,43.43 19.95,43.45 ; v1(29.84,50.17) 30.61,49.4 32.31,49.4 ; 19.95,43.45 19.95,49.15 ; 19.95,43.45 19.94,43.43 18.16,43.43 17.53,42.8 v1(17.27,42.8) ; v1(34.54,1.78) 33.91,2.41 32.42,2.41 ; 32.26,29.59 33.91,29.59 v1(34.42,29.08) ; 32.26,29.59 30.23,29.59 29.72,29.08 v1(29.46,29.08) ; 18.98,9.02 18.98,1.78 ; 18.98,9.02 v1(22.48,9.02) ; 18.98,9.02 v1(17.53,9.02) ; 18.98,1.78 19.02,1.82 21.13,1.82 21.68,2.37 v1(22.19,2.37) ; 19.72,35.81 18.54,35.81 v1(17.53,36.83) ; 19.72,35.81 21.34,35.81 22.1,36.58 22.73,36.58 ; 32.31,49.4 34.04,49.4 v1(34.8,50.17) ; 32.31,49.4 32.31,43.34 32.27,43.31 ; 19.95,49.15 21.08,49.15 21.97,50.04 22.48,50.04 v1(22.61,50.17) ; 19.95,49.15 18.67,49.15 v1(17.65,50.17) ; 32.27,43.31 33.91,43.31 v1(34.42,42.8) ; 32.27,43.31 30.1,43.31 29.59,42.8 v1(29.46,42.8) ; 20,21.84 21.21,21.84 22.1,22.73 v1(23.49,22.73) ; 20,21.84 18.8,21.84 17.91,22.73 v1(17.02,22.73) ; 32.42,2.41 32.42,8.61 32.45,8.64 ; 32.42,2.41 32.3,2.54 30.23,2.54 v1(29.59,1.91) ; 32.45,8.64 30.48,8.64 v1(29.97,9.14) ; 32.45,8.64 34.42,8.64 v1(34.92,9.14)

## Copper pours and planes (outline as drawn; the poured copper is in the pictures)
GND on Top Layer: -1.14,52.83 62.23,52.83 62.23,-2.92 -1.14,-2.92
GND on Bottom Layer: -1.4,52.32 63.12,52.32 63.12,-2.03 -1.4,-2.03
GND on 内层1: -0.89,52.45 62.36,52.45 62.36,-2.03 -0.89,-2.03
GND on 内层2: -2.41,53.34 62.1,53.34 62.1,-3.81 -2.41,-3.81
GND on Inner3: -4.06,54.48 60.33,54.48 60.33,-1.52 -4.06,-1.52
GND on Inner4: -2.03,52.83 59.69,52.83 59.69,-0.89 -2.03,-0.89

Small or netless copper shapes (teardrops, artwork), in the pictures only: 2 on Top Layer, 3 on Bottom Layer, 1 on 内层2, 48 on Inner4

## Text on the board
Top Silkscreen Layer: CAN_H | CAN_L | VCC3V | GND | M2
